# EAGLE schematic motherBoard (EAGLE 8.6.3)
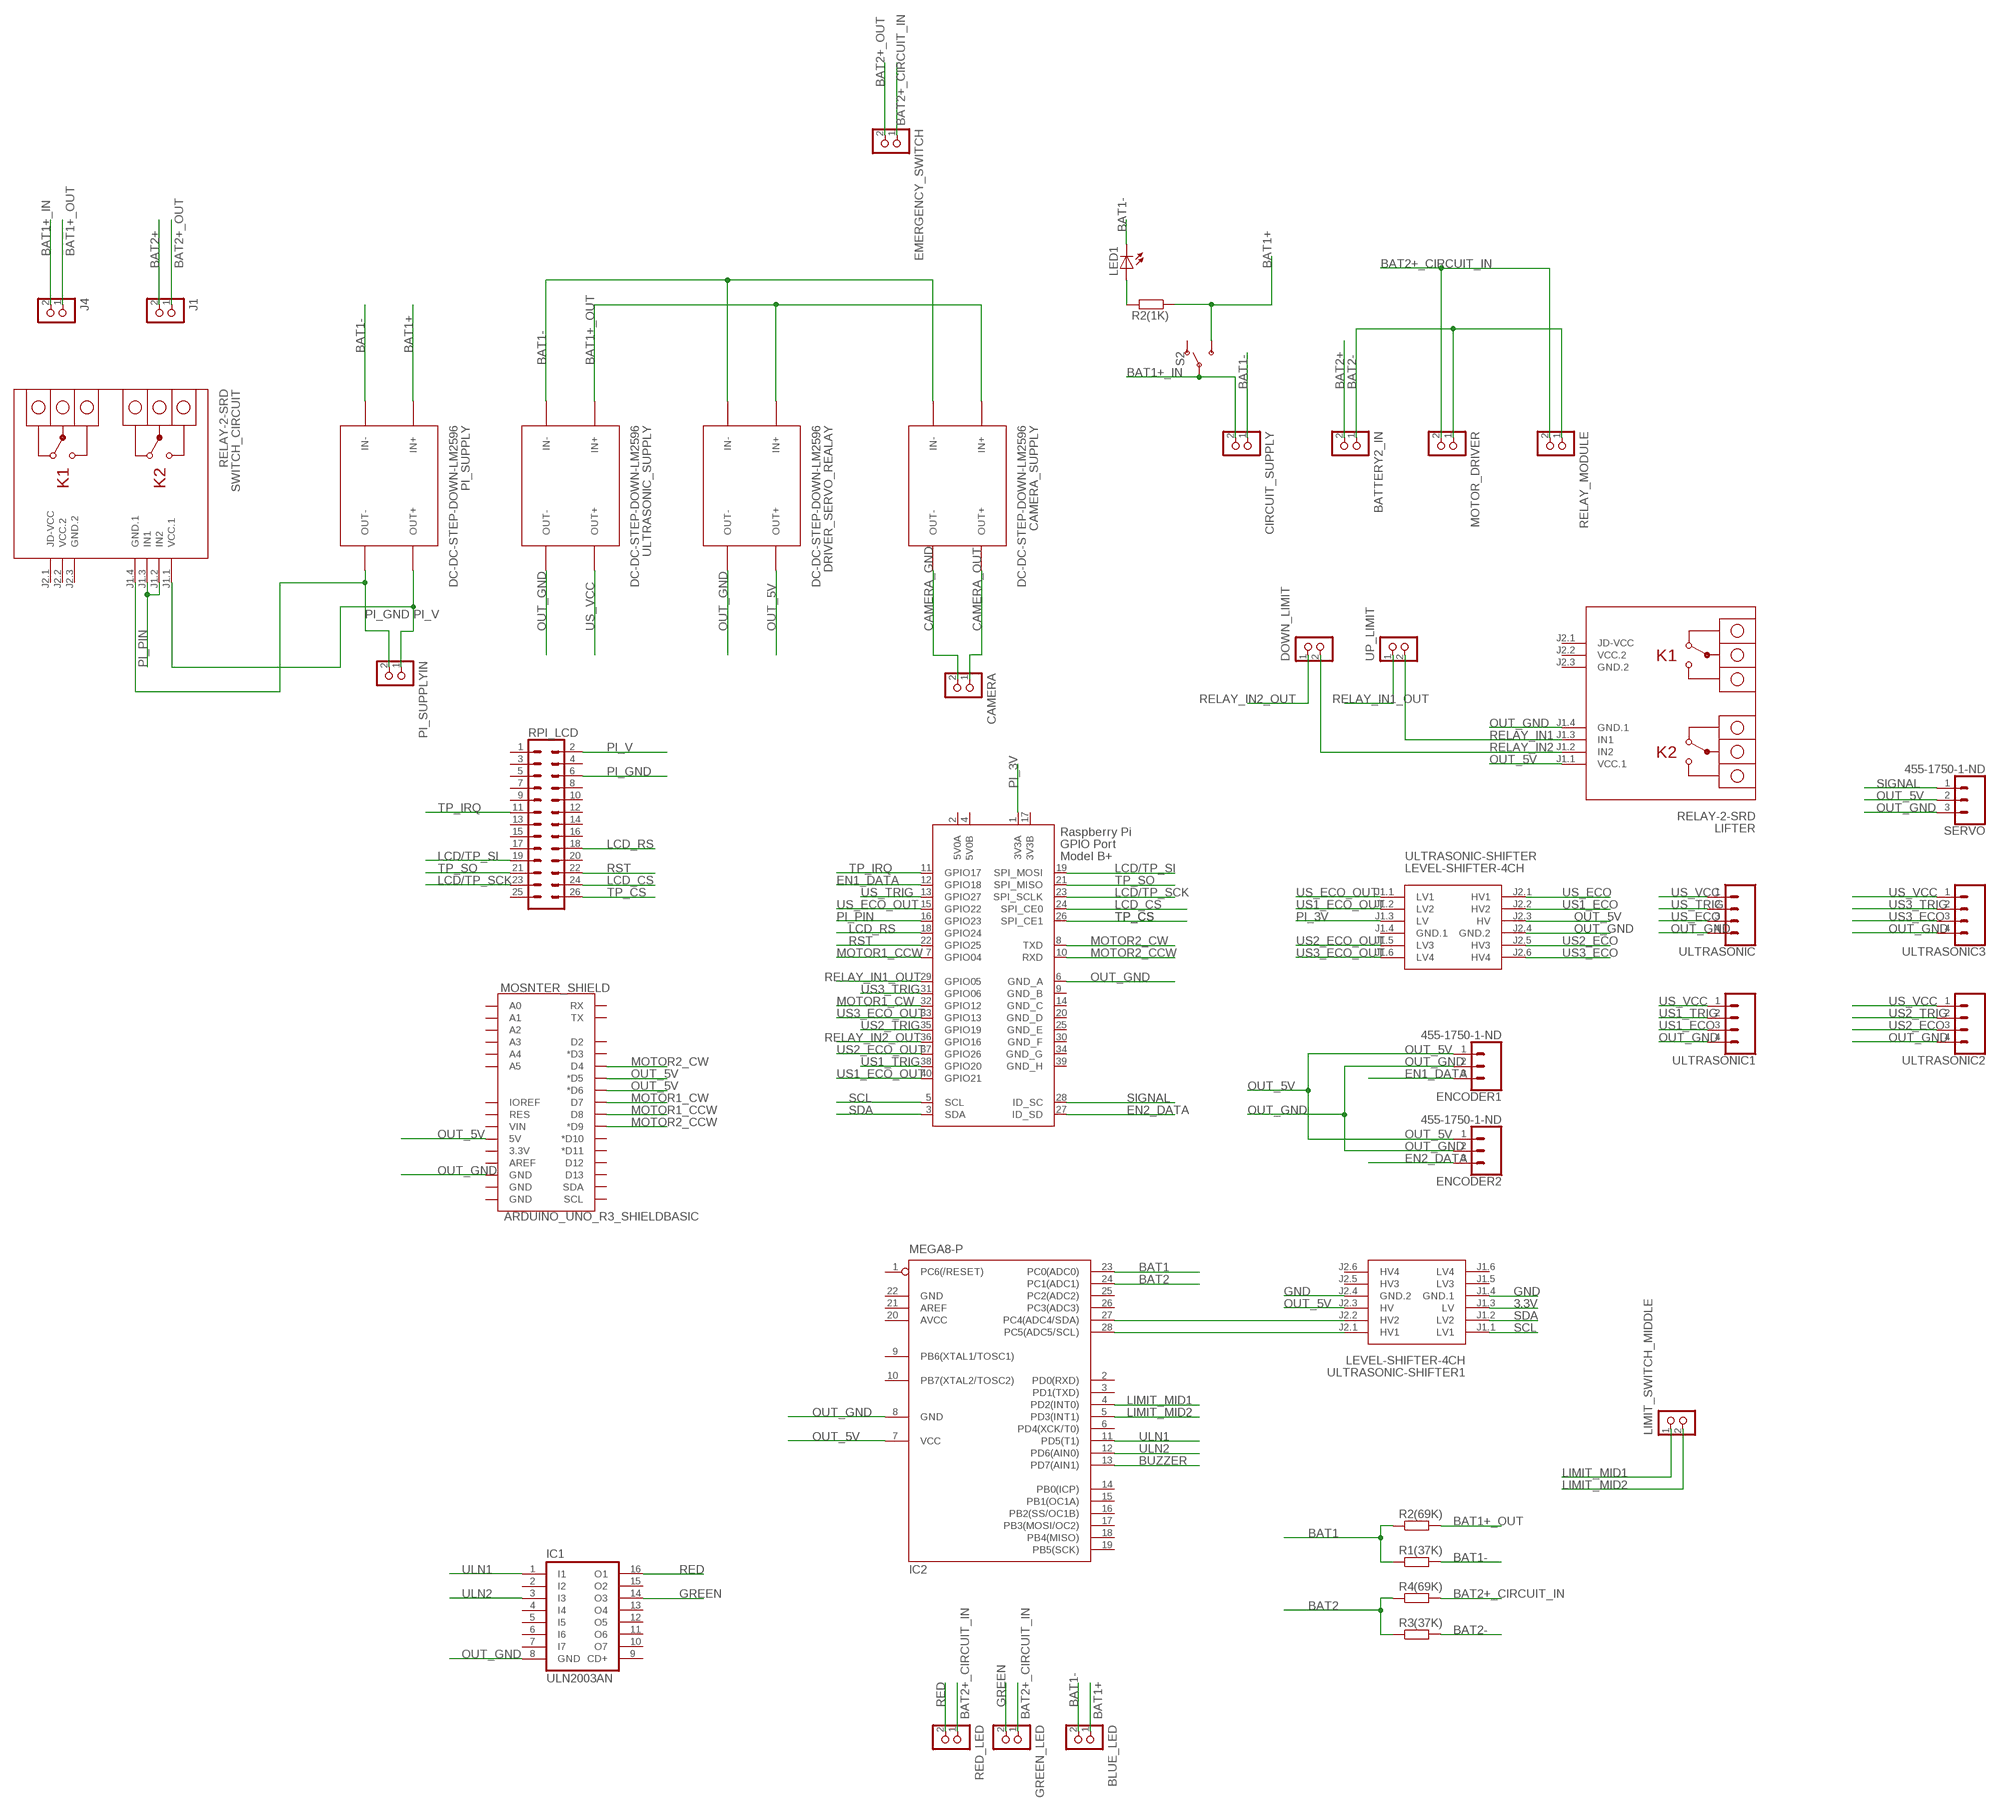
[diagram p0: schematic, sheet 1]

## Parts
BATTERY2_IN  CON_TERMINAL_BLOCK_02-5MM  [TERMINAL_BLOCK_2P_5]
BLUE_LED  CON_TERMINAL_BLOCK_02-5MM  [TERMINAL_BLOCK_2P_5]
CAMERA  CON_TERMINAL_BLOCK_02-5MM  [TERMINAL_BLOCK_2P_5]
CAMERA_SUPPLY  DC-DC-STEP-DOWN-LM2596  [DC-DC-STEP-DOWN-LM2596]
CIRCUIT_SUPPLY  CON_TERMINAL_BLOCK_02-5MM  [TERMINAL_BLOCK_2P_5]
DOWN_LIMIT  CON_TERMINAL_BLOCK_02-5MM  [TERMINAL_BLOCK_2P_5]
DRIVER_SERVO_REALAY  DC-DC-STEP-DOWN-LM2596  [DC-DC-STEP-DOWN-LM2596]
EMERGENCY_SWITCH  CON_TERMINAL_BLOCK_02-5MM  [TERMINAL_BLOCK_2P_5]
ENCODER1  455-1750-1-ND  CONN_03  [1X03]
ENCODER2  455-1750-1-ND  CONN_03  [1X03]
GREEN_LED  CON_TERMINAL_BLOCK_02-5MM  [TERMINAL_BLOCK_2P_5]
IC1  ULN2003AN  [DIL16]
IC2  MEGA8-P  [DIL28-3]
J1  CON_TERMINAL_BLOCK_02-5MM  [TERMINAL_BLOCK_2P_5]
J4  CON_TERMINAL_BLOCK_02-5MM  [TERMINAL_BLOCK_2P_5]
LED1  LED5MM  [LED5MM]
LIFTER  RELAY-2-SRD  [RELAY-2-SRD]
LIMIT_SWITCH_MIDDLE  CON_TERMINAL_BLOCK_02-5MM  [TERMINAL_BLOCK_2P_5]
MOSNTER_SHIELD  ARDUINO_UNO_R3_SHIELDBASIC  [UNO_R3_SHIELD]
MOTOR_DRIVER  CON_TERMINAL_BLOCK_02-5MM  [TERMINAL_BLOCK_2P_5]
PI_SUPPLY  DC-DC-STEP-DOWN-LM2596  [DC-DC-STEP-DOWN-LM2596]
PI_SUPPLYIN  CON_TERMINAL_BLOCK_02-5MM  [TERMINAL_BLOCK_2P_5]
R1(37K)  R-EU_0207/10  [0207/10]
R2(1K)  R-EU_0207/10  [0207/10]
R2(69K)  R-EU_0207/10  [0207/10]
R3(37K)  R-EU_0207/10  [0207/10]
R4(69K)  R-EU_0207/10  [0207/10]
RED_LED  CON_TERMINAL_BLOCK_02-5MM  [TERMINAL_BLOCK_2P_5]
RELAY_MODULE  CON_TERMINAL_BLOCK_02-5MM  [TERMINAL_BLOCK_2P_5]
RPI_LCD  CONN_13X22X13  [2X13]
S2  SWITCH-SPDT-PTH-11.6X4.0MM-KIT  [SWITCH_SPDT_PTH_11.6X4.0MM_KIT]
SERVO  455-1750-1-ND  CONN_03  [1X03]
SWITCH_CIRCUIT  RELAY-2-SRD  [RELAY-2-SRD]
ULTRASONIC  CONN_04PTH  [1X04]
ULTRASONIC1  CONN_04PTH  [1X04]
ULTRASONIC2  CONN_04PTH  [1X04]
ULTRASONIC3  CONN_04PTH  [1X04]
ULTRASONIC-SHIFTER  LEVEL-SHIFTER-4CH  [LEVEL-SHIFTER-4CH]
ULTRASONIC-SHIFTER1  LEVEL-SHIFTER-4CH  [LEVEL-SHIFTER-4CH]
ULTRASONIC_SUPPLY  DC-DC-STEP-DOWN-LM2596  [DC-DC-STEP-DOWN-LM2596]
UP_LIMIT  CON_TERMINAL_BLOCK_02-5MM  [TERMINAL_BLOCK_2P_5]
X1  RASPI_GPIO_B+#_PIN  [RASPI_GPIO_B+_PIN]

## Nets
3.3V: ULTRASONIC-SHIFTER1.J1.3(LV)
BAT1: IC2.23(PC0(ADC0)) R1(37K).1 R2(69K).1
BAT1+: BLUE_LED.1 PI_SUPPLY.IN+ R2(1K).1 S2.3(S)
BAT1+_IN: CIRCUIT_SUPPLY.2 J4.2 S2.2(P)
BAT1+_OUT: CAMERA_SUPPLY.IN+ DRIVER_SERVO_REALAY.IN+ J4.1 R2(69K).2 ULTRASONIC_SUPPLY.IN+
BAT1-: BLUE_LED.2 CAMERA_SUPPLY.IN- CIRCUIT_SUPPLY.1 DRIVER_SERVO_REALAY.IN- LED1.K(C) PI_SUPPLY.IN- R1(37K).2 ULTRASONIC_SUPPLY.IN-
BAT2: IC2.24(PC1(ADC1)) R3(37K).1 R4(69K).1
BAT2+: BATTERY2_IN.2 J1.2
BAT2+_CIRCUIT_IN: EMERGENCY_SWITCH.1 GREEN_LED.1 MOTOR_DRIVER.2 R4(69K).2 RED_LED.1 RELAY_MODULE.2
BAT2+_OUT: EMERGENCY_SWITCH.2 J1.1
BAT2-: BATTERY2_IN.1 MOTOR_DRIVER.1 R3(37K).2 RELAY_MODULE.1
BUZZER: IC2.13(PD7(AIN1))
CAMERA_GND: CAMERA.2 CAMERA_SUPPLY.OUT-
CAMERA_OUT: CAMERA.1 CAMERA_SUPPLY.OUT+
EN1_DATA: ENCODER1.3 X1.12(GPIO18)
EN2_DATA: ENCODER2.3 X1.27(ID_SD)
GND: ULTRASONIC-SHIFTER1.J1.4(GND.1) ULTRASONIC-SHIFTER1.J2.4(GND.2)
GREEN: GREEN_LED.2 IC1.14(O3)
LCD/TP_SCK: RPI_LCD.23 X1.23(SPI_SCLK)
LCD/TP_SI: RPI_LCD.19 X1.19(SPI_MOSI)
LCD_CS: RPI_LCD.24 X1.24(SPI_CE0)
LCD_RS: RPI_LCD.18 X1.18(GPIO24)
LIMIT_MID1: IC2.4(PD2(INT0)) LIMIT_SWITCH_MIDDLE.1
LIMIT_MID2: IC2.5(PD3(INT1)) LIMIT_SWITCH_MIDDLE.2
MOTOR1_CCW: MOSNTER_SHIELD.D8 X1.7(GPIO04)
MOTOR1_CW: MOSNTER_SHIELD.D7 X1.32(GPIO12)
MOTOR2_CCW: MOSNTER_SHIELD.D9(*D9) X1.10(RXD)
MOTOR2_CW: MOSNTER_SHIELD.D4 X1.8(TXD)
N$2: LED1.A R2(1K).2
N$4: IC2.28(PC5(ADC5/SCL)) ULTRASONIC-SHIFTER1.J2.1(HV1)
OUT_5V: DRIVER_SERVO_REALAY.OUT+ ENCODER1.1 ENCODER2.1 IC2.7(VCC) LIFTER.J1.1(VCC.1) MOSNTER_SHIELD.5V MOSNTER_SHIELD.D5(*D5) MOSNTER_SHIELD.D6(*D6) SERVO.2 ULTRASONIC-SHIFTER1.J2.3(HV) ULTRASONIC-SHIFTER.J2.3(HV)
OUT_GND: DRIVER_SERVO_REALAY.OUT- ENCODER1.2 ENCODER2.2 IC1.8(GND) IC2.8(GND) LIFTER.J1.4(GND.1) MOSNTER_SHIELD.GND@2(GND) SERVO.3 ULTRASONIC1.4 ULTRASONIC2.4 ULTRASONIC3.4 ULTRASONIC-SHIFTER.J2.4(GND.2) ULTRASONIC.4 ULTRASONIC_SUPPLY.OUT- X1.6(GND_A)
PI_3V: ULTRASONIC-SHIFTER.J1.3(LV) X1.1(3V3A)
PI_GND: PI_SUPPLY.OUT- PI_SUPPLYIN.2 RPI_LCD.6 SWITCH_CIRCUIT.J1.4(GND.1)
PI_PIN: SWITCH_CIRCUIT.J1.2(IN2) SWITCH_CIRCUIT.J1.3(IN1) X1.16(GPIO23)
PI_V: PI_SUPPLY.OUT+ PI_SUPPLYIN.1 RPI_LCD.2 SWITCH_CIRCUIT.J1.1(VCC.1)
RED: IC1.16(O1) RED_LED.2
RELAY_IN1: LIFTER.J1.3(IN1) UP_LIMIT.2
RELAY_IN1_OUT: UP_LIMIT.1 X1.29(GPIO05)
RELAY_IN2: DOWN_LIMIT.2 LIFTER.J1.2(IN2)
RELAY_IN2_OUT: DOWN_LIMIT.1 X1.36(GPIO16)
RST: RPI_LCD.22 X1.22(GPIO25)
SCL: ULTRASONIC-SHIFTER1.J1.1(LV1) X1.5(SCL)
SDA: IC2.27(PC4(ADC4/SDA)) ULTRASONIC-SHIFTER1.J1.2(LV2) ULTRASONIC-SHIFTER1.J2.2(HV2) X1.3(SDA)
SIGNAL: SERVO.1 X1.28(ID_SC)
TP_CS: RPI_LCD.26 X1.26(SPI_CE1)
TP_IRQ: RPI_LCD.11 X1.11(GPIO17)
TP_SO: RPI_LCD.21 X1.21(SPI_MISO)
ULN1: IC1.1(I1) IC2.11(PD5(T1))
ULN2: IC1.3(I3) IC2.12(PD6(AIN0))
US1_ECO: ULTRASONIC1.3 ULTRASONIC-SHIFTER.J2.2(HV2)
US1_ECO_OUT: ULTRASONIC-SHIFTER.J1.2(LV2) X1.40(GPIO21)
US1_TRIG: ULTRASONIC1.2 X1.38(GPIO20)
US2_ECO: ULTRASONIC2.3 ULTRASONIC-SHIFTER.J2.5(HV3)
US2_ECO_OUT: ULTRASONIC-SHIFTER.J1.5(LV3) X1.37(GPIO26)
US2_TRIG: ULTRASONIC2.2 X1.35(GPIO19)
US3_ECO: ULTRASONIC3.3 ULTRASONIC-SHIFTER.J2.6(HV4)
US3_ECO_OUT: ULTRASONIC-SHIFTER.J1.6(LV4) X1.33(GPIO13)
US3_TRIG: ULTRASONIC3.2 X1.31(GPIO06)
US_ECO: ULTRASONIC-SHIFTER.J2.1(HV1) ULTRASONIC.3
US_ECO_OUT: ULTRASONIC-SHIFTER.J1.1(LV1) X1.15(GPIO22)
US_TRIG: ULTRASONIC.2 X1.13(GPIO27)
US_VCC: ULTRASONIC1.1 ULTRASONIC2.1 ULTRASONIC3.1 ULTRASONIC.1 ULTRASONIC_SUPPLY.OUT+
Unconnected: IC1.2(I2) IC1.4(I4) IC1.5(I5) IC1.6(I6) IC1.7(I7) IC1.9(CD+) IC1.10(O7) IC1.11(O6) IC1.12(O5) IC1.13(O4) IC1.15(O2) IC2.1(PC6(/RESET)) IC2.2(PD0(RXD)) IC2.3(PD1(TXD)) IC2.6(PD4(XCK/T0)) IC2.9(PB6(XTAL1/TOSC1)) IC2.10(PB7(XTAL2/TOSC2)) IC2.14(PB0(ICP)) IC2.15(PB1(OC1A)) IC2.16(PB2(SS/OC1B)) IC2.17(PB3(MOSI/OC2)) IC2.18(PB4(MISO)) IC2.19(PB5(SCK)) IC2.21(AREF) IC2.25(PC2(ADC2)) IC2.26(PC3(ADC3)) LIFTER.J2.1(JD-VCC) MOSNTER_SHIELD.3.3V MOSNTER_SHIELD.A0 MOSNTER_SHIELD.A1 MOSNTER_SHIELD.A2 MOSNTER_SHIELD.A3 MOSNTER_SHIELD.A4 MOSNTER_SHIELD.A5 MOSNTER_SHIELD.AREF MOSNTER_SHIELD.D2 MOSNTER_SHIELD.D3(*D3) MOSNTER_SHIELD.D10(*D10) MOSNTER_SHIELD.D11(*D11) MOSNTER_SHIELD.D12 MOSNTER_SHIELD.D13 MOSNTER_SHIELD.GND@0(GND) MOSNTER_SHIELD.GND@1(GND) MOSNTER_SHIELD.IOREF MOSNTER_SHIELD.RES MOSNTER_SHIELD.RX MOSNTER_SHIELD.SCL MOSNTER_SHIELD.SDA MOSNTER_SHIELD.TX MOSNTER_SHIELD.VIN RPI_LCD.1 RPI_LCD.3 RPI_LCD.4 RPI_LCD.5 RPI_LCD.7 RPI_LCD.8 RPI_LCD.9 RPI_LCD.10 RPI_LCD.12 RPI_LCD.13 RPI_LCD.14 RPI_LCD.15 RPI_LCD.16 RPI_LCD.17 RPI_LCD.20 RPI_LCD.25 S2.1(O) SWITCH_CIRCUIT.J2.1(JD-VCC) ULTRASONIC-SHIFTER1.J1.5(LV3) ULTRASONIC-SHIFTER1.J1.6(LV4) ULTRASONIC-SHIFTER1.J2.5(HV3) ULTRASONIC-SHIFTER1.J2.6(HV4)

## Power pins joined to a net without a drawn wire
3V3B: X1.17(3V3B)
5V0A: X1.2(5V0A)
5V0B: X1.4(5V0B)
AVCC: IC2.20(AVCC)
GND: IC2.22(GND)
GND.1: ULTRASONIC-SHIFTER.J1.4(GND.1)
GND.2: LIFTER.J2.3(GND.2) SWITCH_CIRCUIT.J2.3(GND.2)
GND_B: X1.9(GND_B)
GND_C: X1.14(GND_C)
GND_D: X1.20(GND_D)
GND_E: X1.25(GND_E)
GND_F: X1.30(GND_F)
GND_G: X1.34(GND_G)
GND_H: X1.39(GND_H)
VCC.2: LIFTER.J2.2(VCC.2) SWITCH_CIRCUIT.J2.2(VCC.2)

## Library data of the parts
BATTERY2_IN BLUE_LED CAMERA CIRCUIT_SUPPLY DOWN_LIMIT EMERGENCY_SWITCH GREEN_LED J1 J4 LIMIT_SWITCH_MIDDLE MOTOR_DRIVER PI_SUPPLYIN RED_LED RELAY_MODULE UP_LIMIT = dp_devices.v6:CON_TERMINAL_BLOCK_02: 2 poles wire to board terminal block
CAMERA_SUPPLY DRIVER_SERVO_REALAY PI_SUPPLY ULTRASONIC_SUPPLY = diy-modules (1):DC-DC-STEP-DOWN-LM2596: DC/DC Step-Down Regulator based on LM2596-ADJ chip LM2596 datasheet available here: http://www.ti.com/lit/ds/symlink/lm2596.pdf Click here to find device on ebay.com <http://www.ebay.com/sch/lm2596+power+regulator>
ENCODER1 ENCODER2 SERVO = SparkFun-Connectors:CONN_03: Multi connection point. Often used as Generic Header-pin footprint for 0.1 inch spaced/style header connections On any of the 0.1 inch spaced packages, you can populate with these: Break Away Headers - Straight <https://www.sparkfun.com/products/116> (PRT-00116) Break Away Male Headers - Right Angle <https://www.sparkfun.com/products/553> (PRT-00553) Female Headers <https://www.sparkfun.com/products/115> (PRT-00115) Break Away Headers - Machine Pin <https://www.sparkfun.com/products/117> (PRT-00117) Break Away Female Headers - Swiss Machine Pin <https://www.sparkfun.com/products/743> (PRT-00743) Stackable Header - 3 Pin (Female, 0.1") <https://www.sparkfun.com/products/13875> (PRT-13875) For SCREWTERMINALS and SPRING TERMINALS visit here: Screw Terimnals on SparkFun.com <https://www.sparkfun.com/search/results?term=Screw+Terminals> (5mm/3.5mm/2.54mm spacing) This device is also useful as a general connection point to wire up your design to another part of your project. Our various solder wires solder well into these plated through hole pads. Hook-Up Wire - Assortment (Stranded, 22 AWG) <https://www.sparkfun.com/products/11375> (PRT-11375) Hook-Up Wire - Assortment (Solid Core, 22 AWG) <https://www.sparkfun.com/products/11367> (PRT-11367) View the entire wire category on our website here <https://www.sparkfun.com/categories/141> Special notes: Molex polarized connector foot print use with SKU : PRT-08232 with associated crimp pins and housings.; PROD_ID: XXX-00000
IC1 = uln-udn (1):ULN2003A: DRIVER ARRAY
IC2 = atmel:MEGA8-P: MICROCONTROLLER 8 Kbytes FLASH, 1 kbytes SRAM, 512 bytes EEPROM, USART, 4-channel 10 bit ADC, 2-channel 8 bit ADC Pin compatible with Atmega48, ATMega88, ATMega168 Source: avr.lbr; OC_FARNELL: unknown; OC_NEWARK: unknown
LED1 = led:LED: LED OSRAM: - CHIPLED LG R971, LG N971, LY N971, LG Q971, LY Q971, LO R971, LY R971 LH N974, LH R974 LS Q976, LO Q976, LY Q976 LO Q996 - Hyper CHIPLED LW Q18S LB Q993, LB Q99A, LB R99A - SideLED LS A670, LO A670, LY A670, LG A670, LP A670 LB A673, LV A673, LT A673, LW A673 LH A674 LY A675 LS A676, LA A676, LO A676, LY A676, LW A676 LS A679, LY A679, LG A679 - Hyper Micro SIDELED® LS Y876, LA Y876, LO Y876, LY Y876 LT Y87S - SmartLED LW L88C, LW L88S LB L89C, LB L89S, LG L890 LS L89K, LO L89K, LY L89K LS L896, LA L896, LO L896, LY L896 - TOPLED LS T670, LO T670, LY T670, LG T670, LP T670 LSG T670, LSP T670, LSY T670, LOP T670, LYG T670 LG T671, LOG T671, LSG T671 LB T673, LV T673, LT T673, LW T673 LH T674 LS T676, LA T676, LO T676, LY T676, LB T676, LH T676, LSB T676, LW T676 LB T67C, LV T67C, LT T67C, LS T67K, LO T67K, LY T67K, LW E67C LS E67B, LA E67B, LO E67B, LY E67B, LB E67C, LV E67C, LT E67C LW T67C LS T679, LY T679, LG T679 LS T770, LO T770, LY T770, LG T770, LP T770 LB T773, LV T773, LT T773, LW T773 LH T774 LS E675, LA E675, LY E675, LS T675 LS T776, LA T776, LO T776, LY T776, LB T776 LHGB T686 LT T68C, LB T68C - Hyper Mini TOPLED® LB M676 - Mini TOPLED Santana® LG M470 LS M47K, LO M47K, LY M47K Source: http://www.osram.convergy.de LUXEON: - LUMILED® LXK2-PW12-R00, LXK2-PW12-S00, LXK2-PW14-U00, LXK2-PW14-V00 LXK2-PM12-R00, LXK2-PM12-S00, LXK2-PM14-U00 LXK2-PE12-Q00, LXK2-PE12-R00, LXK2-PE12-S00, LXK2-PE14-T00, LXK2-PE14-U00 LXK2-PB12-K00, LXK2-PB12-L00, LXK2-PB12-M00, LXK2-PB14-N00, LXK2-PB14-P00, LXK2-PB14-Q00 LXK2-PR12-L00, LXK2-PR12-M00, LXK2-PR14-Q00, LXK2-PR14-R00 LXK2-PD12-Q00, LXK2-PD12-R00, LXK2-PD12-S00 LXK2-PH12-R00, LXK2-PH12-S00 LXK2-PL12-P00, LXK2-PL12-Q00, LXK2-PL12-R00 Source: www.luxeon.com KINGBRIGHT: KA-3528ASYC Source: www.kingbright.com
LIFTER SWITCH_CIRCUIT = diy-modules (1):RELAY-2-SRD: 2-Channel Relay Module based on SRD-05VDC-SL-C relays Click here to find device on ebay.com <http://www.ebay.com/sch/two+channel+relay+module+optocoupler+5v>
MOSNTER_SHIELD = SparkFun-Boards:ARDUINO_UNO_R3_SHIELD: Arduino R3 Shield Footprint Shield form compatible with the Arduino Uno R3. SparkFun Products: MG2639 Cellular Shield <https://www.sparkfun.com/products/13120> MIDI Shield <https://www.sparkfun.com/products/12898> R3 Stackable Headers Kit <https://www.sparkfun.com/products/11417>
R1(37K) R2(1K) R2(69K) R3(37K) R4(69K) = rcl:R-EU_: RESISTOR, European symbol; SPICEPREFIX: R
RPI_LCD = SparkFun-Connectors:CONN_13X2: Multi connection point. Often used as Generic Header-pin footprint for 0.1 inch spaced/style header connections On any of the 0.1 inch spaced packages, you can populate with these: Break Away Headers - Straight <https://www.sparkfun.com/products/116> (PRT-00116) Break Away Male Headers - Right Angle <https://www.sparkfun.com/products/553> (PRT-00553) Female Headers <https://www.sparkfun.com/products/115> (PRT-00115) Break Away Headers - Machine Pin <https://www.sparkfun.com/products/117> (PRT-00117) Break Away Female Headers - Swiss Machine Pin <https://www.sparkfun.com/products/743> (PRT-00743)
S2 = SparkFun-Switches:SWITCH-SPDT: Single Pole, Double Throw (SPDT) Switch Single-pole, double-throw (SPDT) switch. Variant Overview SMD-AYZ0202 Surface Mount DPDT Switch <https://www.sparkfun.com/products/597> (COM-00597) Used on e.g. LilyPad Arduino USB - ATmega32U4 Board <https://www.sparkfun.com/products/12049> PTH-11.6X4.0MM SPDT Mini Power Switch <https://www.sparkfun.com/products/102> (COM-00102) Used on e.g. SparkFun Simon Says - Through-Hole Soldering Kit <https://www.sparkfun.com/products/10547> (KIT-10547) PTH-11.6X4.0MM-KIT KIT version of SPDT Mini Power Switch - Simplifies soldering by removing tStop of switch pins - only one side can be soldered. PTH-11.6X4.0MM-LOCK LOCK version of SPDT Mini Power Switch - Offset pins hold switch in place for easier soldering. SMD-RIGHT-ANGLE Surface Mount Right Angle Switch <https://www.sparkfun.com/products/10860> (COM-10860) Used on e.g. SparkFun ESP8266 Thing <https://www.sparkfun.com/products/13231>; PROD_ID: SWCH-08261; SF_SKU: COM-00102
ULTRASONIC ULTRASONIC1-ULTRASONIC3 = SparkFun-Connectors:CONN_04: Multi connection point. Often used as Generic Header-pin footprint for 0.1 inch spaced/style header connections On any of the 0.1 inch spaced packages, you can populate with these: Break Away Headers - Straight <https://www.sparkfun.com/products/116> (PRT-00116) Break Away Male Headers - Right Angle <https://www.sparkfun.com/products/553> (PRT-00553) Female Headers <https://www.sparkfun.com/products/115> (PRT-00115) Break Away Headers - Machine Pin <https://www.sparkfun.com/products/117> (PRT-00117) Break Away Female Headers - Swiss Machine Pin <https://www.sparkfun.com/products/743> (PRT-00743) For SCREWTERMINALS and SPRING TERMINALS visit here: Screw Terimnals on SparkFun.com <https://www.sparkfun.com/search/results?term=Screw+Terminals> (5mm/3.5mm/2.54mm spacing) This device is also useful as a general connection point to wire up your design to another part of your project. Our various solder wires solder well into these plated through hole pads. Hook-Up Wire - Assortment (Stranded, 22 AWG) <https://www.sparkfun.com/products/11375> (PRT-11375) Hook-Up Wire - Assortment (Solid Core, 22 AWG) <https://www.sparkfun.com/products/11367> (PRT-11367) View the entire wire category on our website here <https://www.sparkfun.com/categories/141> Special notes: Molex polarized connector foot print use with SKU : PRT-08231 with associated crimp pins and housings. 1MM SMD Version SKU: PRT-10208; PROD_ID: CONN-09696
ULTRASONIC-SHIFTER ULTRASONIC-SHIFTER1 = diy-modules (1):LEVEL-SHIFTER-4CH: 4-Channel Bi-Directional Logic Level Converter based on BSS128 transistors Click here to find device on ebay.com <http://www.ebay.com/sch/i2c+logic+converter+module>
X1 = raspberrypi_bastelstube_v13:RASPI_GPIO_B+#: 2x20 header connector, all pins connected

## Net classes
0 default: width 0.711 mm, clearance 0.254 mm